# Altium schematic sheet Display.SchDoc
size A4; SheetNumber: 4; SheetTotal: 4
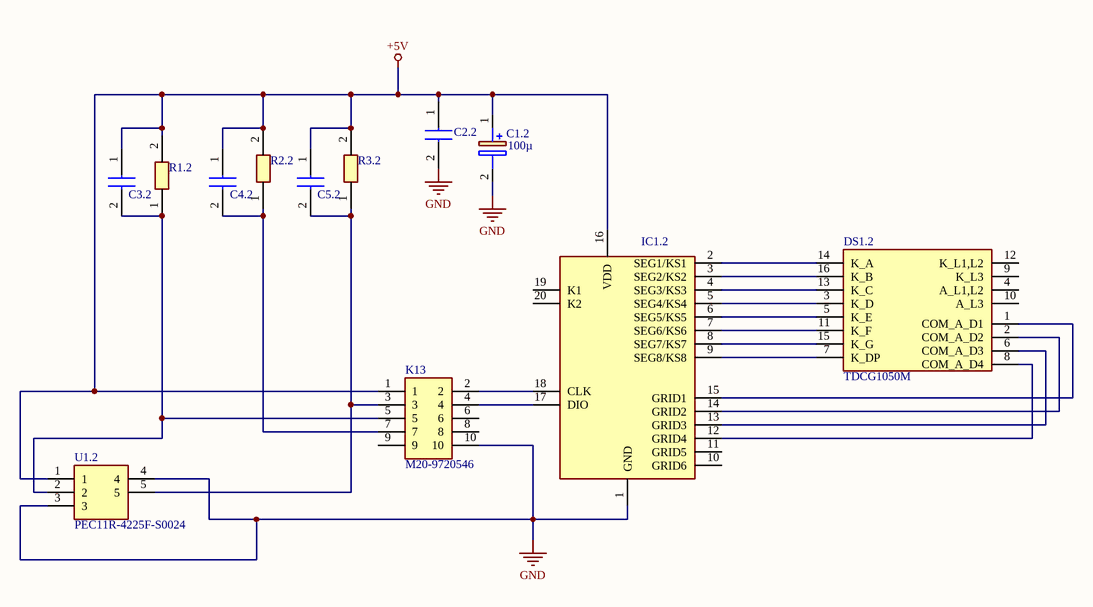
[diagram p0: Display.SchDoc]

## Parts
C1.2  100µ  [CAPPRD200W52D500H1250]
C2.2  860010674014  [CAPPRD350W52D800H1300]  (value not drawn)
C3.2  860010674014  [CAPPRD350W52D800H1300]  (value not drawn)
C4.2  860010674014  [CAPPRD350W52D800H1300]  (value not drawn)
C5.2  860010674014  [CAPPRD350W52D800H1300]  (value not drawn)
DS1.2  TDCG1050M  [DIPS1016W75P254L4020H725Q16N]
IC1.2  TM1637__SOP_  [SOIC127P1045X280-20N]  (value not drawn)
K13  M20-9720546  [HDRV10W64P254_2X5_1270X508X954P]
R1.2  (no value)  [RESC2012X90N]
R2.2  (no value)  [RESC2012X90N]
R3.2  (no value)  [RESC2012X90N]
U1.2  PEC11R-4225F-S0024  [PEC12R-4XXXF-SXXXX_1]

## Nets
+5V: C1.2.1(+) C2.2.1(+) C3.2.1(+) C4.2.1(+) C5.2.1(+) IC1.2.16(VDD) K13.1 R1.2.2 R2.2.2 R3.2.2 U1.2.1
GND: C1.2.2(-) C2.2.2(-) IC1.2.1(GND) K13.10 U1.2.3 U1.2.4
NetC3.2_2: C3.2.2(-) K13.5 R1.2.1 U1.2.2
NetC4.2_2: C4.2.2(-) K13.7 R2.2.1
NetC5.2_2: C5.2.2(-) K13.3 R3.2.1 U1.2.5
NetDS1.2_1: DS1.2.1(COM_A_D1) IC1.2.15(GRID1)
NetDS1.2_2: DS1.2.2(COM_A_D2) IC1.2.14(GRID2)
NetDS1.2_3: DS1.2.3(K_D) IC1.2.5(SEG4/KS4)
NetDS1.2_5: DS1.2.5(K_E) IC1.2.6(SEG5/KS5)
NetDS1.2_6: DS1.2.6(COM_A_D3) IC1.2.13(GRID3)
NetDS1.2_7: DS1.2.7(K_DP) IC1.2.9(SEG8/KS8)
NetDS1.2_8: DS1.2.8(COM_A_D4) IC1.2.12(GRID4)
NetDS1.2_11: DS1.2.11(K_F) IC1.2.7(SEG6/KS6)
NetDS1.2_13: DS1.2.13(K_C) IC1.2.4(SEG3/KS3)
NetDS1.2_14: DS1.2.14(K_A) IC1.2.2(SEG1/KS1)
NetDS1.2_15: DS1.2.15(K_G) IC1.2.8(SEG7/KS7)
NetDS1.2_16: DS1.2.16(K_B) IC1.2.3(SEG2/KS2)
NetIC1.2_17: IC1.2.17(DIO) K13.4
NetIC1.2_18: IC1.2.18(CLK) K13.2

Not connected (* = marked no-connect by the designer): DS1.2 4(A_L1,L2) 9(K_L3) 10(A_L3) 12(K_L1,L2); IC1.2 10(GRID6) 11(GRID5) 19(K1) 20(K2); K13 6 8 9

## Library data of the parts
C1.2 = 860010672009: Capacitor Polarised; Manufacturer_Name: Wurth Elektronik; Datasheet Link: https://componentsearchengine.com/Datasheets/2/860010672009.pdf; Height: 12.5mm; Manufacturer_Part_Number: 860010672009; Mouser Part Number: 710-860010672009; Mouser Price/Stock: https://www.mouser.com/Search/Refine.aspx?Keyword=710-860010672009
C2.2 C3.2 C4.2 C5.2 = 860010674014: Capacitor; Manufacturer_Name: Wurth Elektronik; Datasheet Link: http://uk.rs-online.com/web/p/products/8397074; Height: 13mm; Manufacturer_Part_Number: 860010674014; Mouser Part Number: 710-860010674014; Mouser Price/Stock: https://www.mouser.co.uk/ProductDetail/Wurth-Elektronik/860010674014?qs=0KOYDY2FL2%2Fk%2F1RkUOIquw%3D%3D
DS1.2 = TDCG1050M: Display; Manufacturer_Name: Vishay; Datasheet Link: https://www.vishay.com/docs/83180/tdcx10x0m.pdf; Height: 7.25mm; Manufacturer_Part_Number: TDCG1050M; Mouser Part Number: 78-TDCG1050; Mouser Price/Stock: https://www.mouser.co.uk/ProductDetail/Vishay-Semiconductors/TDCG1050M?qs=RzxYCzJDjPUa0IQ9xsk9iw%3D%3D; Arrow Part Number: TDCG1050M; Arrow Price/Stock: https://www.arrow.com/en/products/tdcg1050m/vishay?region=nac
IC1.2 = TM1637__SOP_: Integrated Circuit; Manufacturer_Name: TITAN MICRO ELECTRONICS; Manufacturer_Part_Number: TM1637 (SOP); Datasheet Link: https://www.mcielectronics.cl/website_MCI/static/documents/Datasheet_TM1637.pdf; Height: 2.8mm
K13 = M20-9720546: Connector; Manufacturer_Name: Harwin; Datasheet Link: https://cdn.harwin.com/pdfs/M20-972.pdf; Height: 9.54mm; Manufacturer_Part_Number: M20-9720546
R1.2 R2.2 R3.2 = CFN0805-JZ-R010ELF: Resistor; Manufacturer_Name: Bourns; Datasheet Link: https://www.bourns.com/docs/Product-Datasheets/CFN.pdf; Height: 0.9mm; Manufacturer_Part_Number: CFN0805-JZ-R010ELF
U1.2 = PEC11R-4225F-S0024: Undefined or Miscellaneous; Manufacturer_Name: Bourns; Datasheet Link: https://componentsearchengine.com/Datasheets/1/PEC11R-4225F-S0024.pdf; Manufacturer_Part_Number: PEC11R-4225F-S0024; Mouser Part Number: 652-PEC11R-4225F-S24; Mouser Price/Stock: https://www.mouser.co.uk/ProductDetail/Bourns/PEC11R-4225F-S0024?qs=Zq5ylnUbLm4N6UNkPX3pkQ%3D%3D; Arrow Part Number: PEC11R-4225F-S0024; Arrow Price/Stock: https://www.arrow.com/en/products/pec11r-4225f-s0024/bourns?region=nac